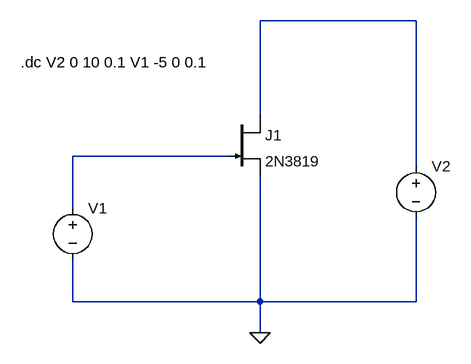
[diagram p0: schematic Experiment 4.asc]
Experiment 4.asc, the LTspice schematic file:
Version 4
SHEET 1 880 680
WIRE 672 -80 432 -80
WIRE 432 64 432 -80
WIRE 384 128 144 128
WIRE 672 144 672 -80
WIRE 144 208 144 128
WIRE 144 352 144 288
WIRE 432 352 432 160
WIRE 432 352 144 352
WIRE 672 352 672 224
WIRE 672 352 432 352
WIRE 432 400 432 352
FLAG 432 400 0
SYMBOL voltage 672 128 R0
WINDOW 123 0 0 Left 0
WINDOW 39 0 0 Left 0
SYMATTR InstName V2
SYMATTR Value ""
SYMBOL njf 384 64 R0
SYMATTR InstName J1
SYMATTR Value 2N3819
SYMBOL voltage 144 192 R0
WINDOW 123 0 0 Left 0
WINDOW 39 24 124 Left 2
SYMATTR InstName V1
SYMATTR Value ""
TEXT 64 -16 Left 2 !.dc V2 0 10 0.1 V1 -5 0 0.1

The netlist it stands for:
* Experiment 4.asc
V2 N001 0
J1 N001 N002 0 2N3819
V1 N002 0
.model NJF NJF
.model PJF PJF
.lib standard.jft
.dc V2 0 10 0.1 V1 -5 0 0.1
.backanno
.end